# EAGLE schematic pi3_hat (EAGLE 9.6.0)
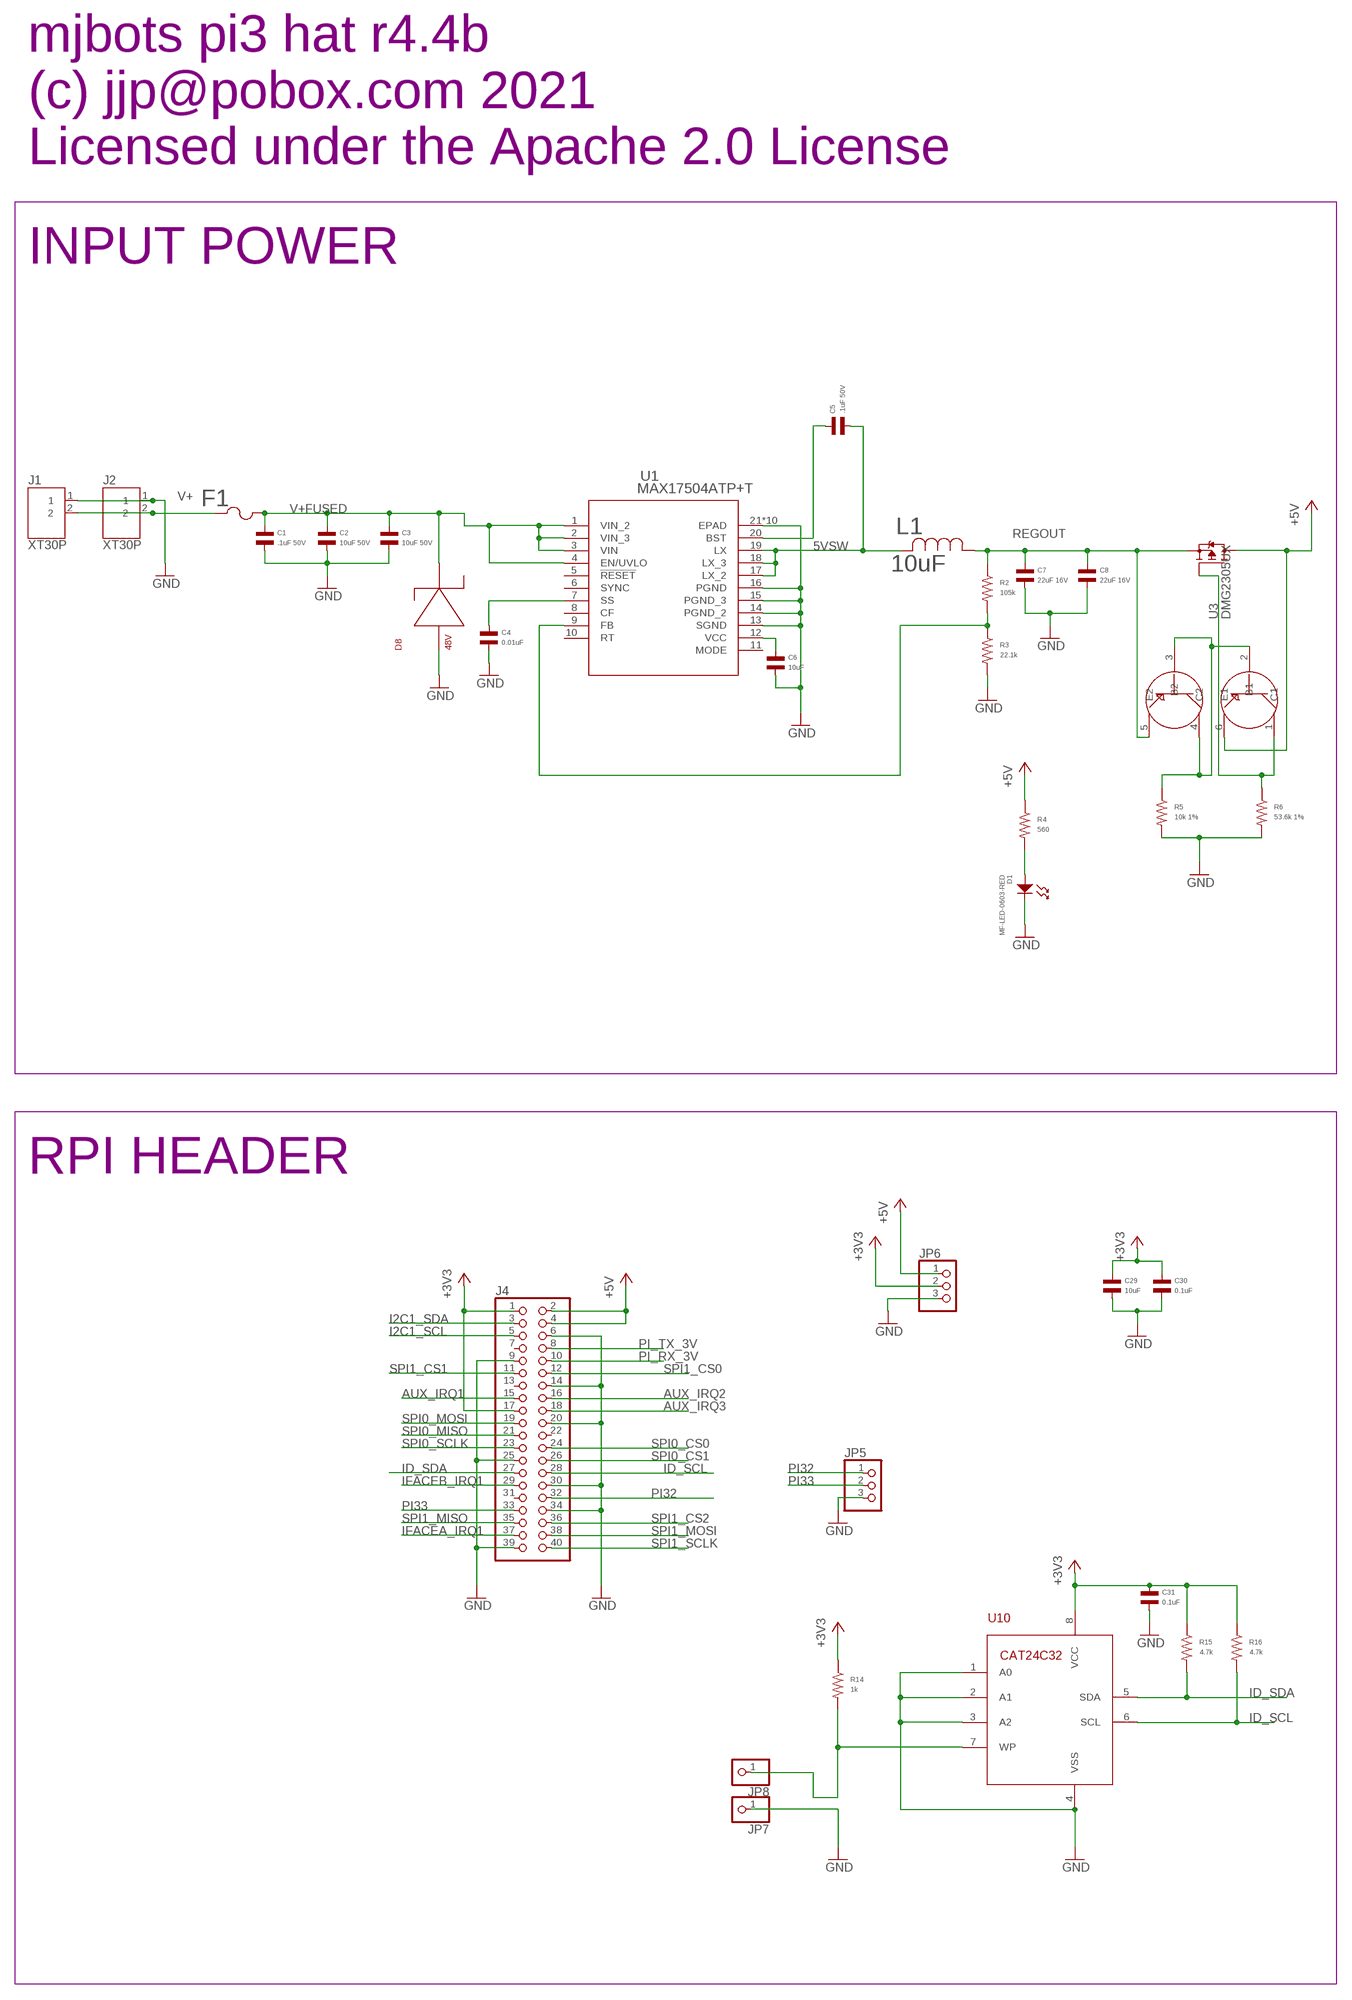
[diagram p0: schematic, sheet 1, part 1 of 3]
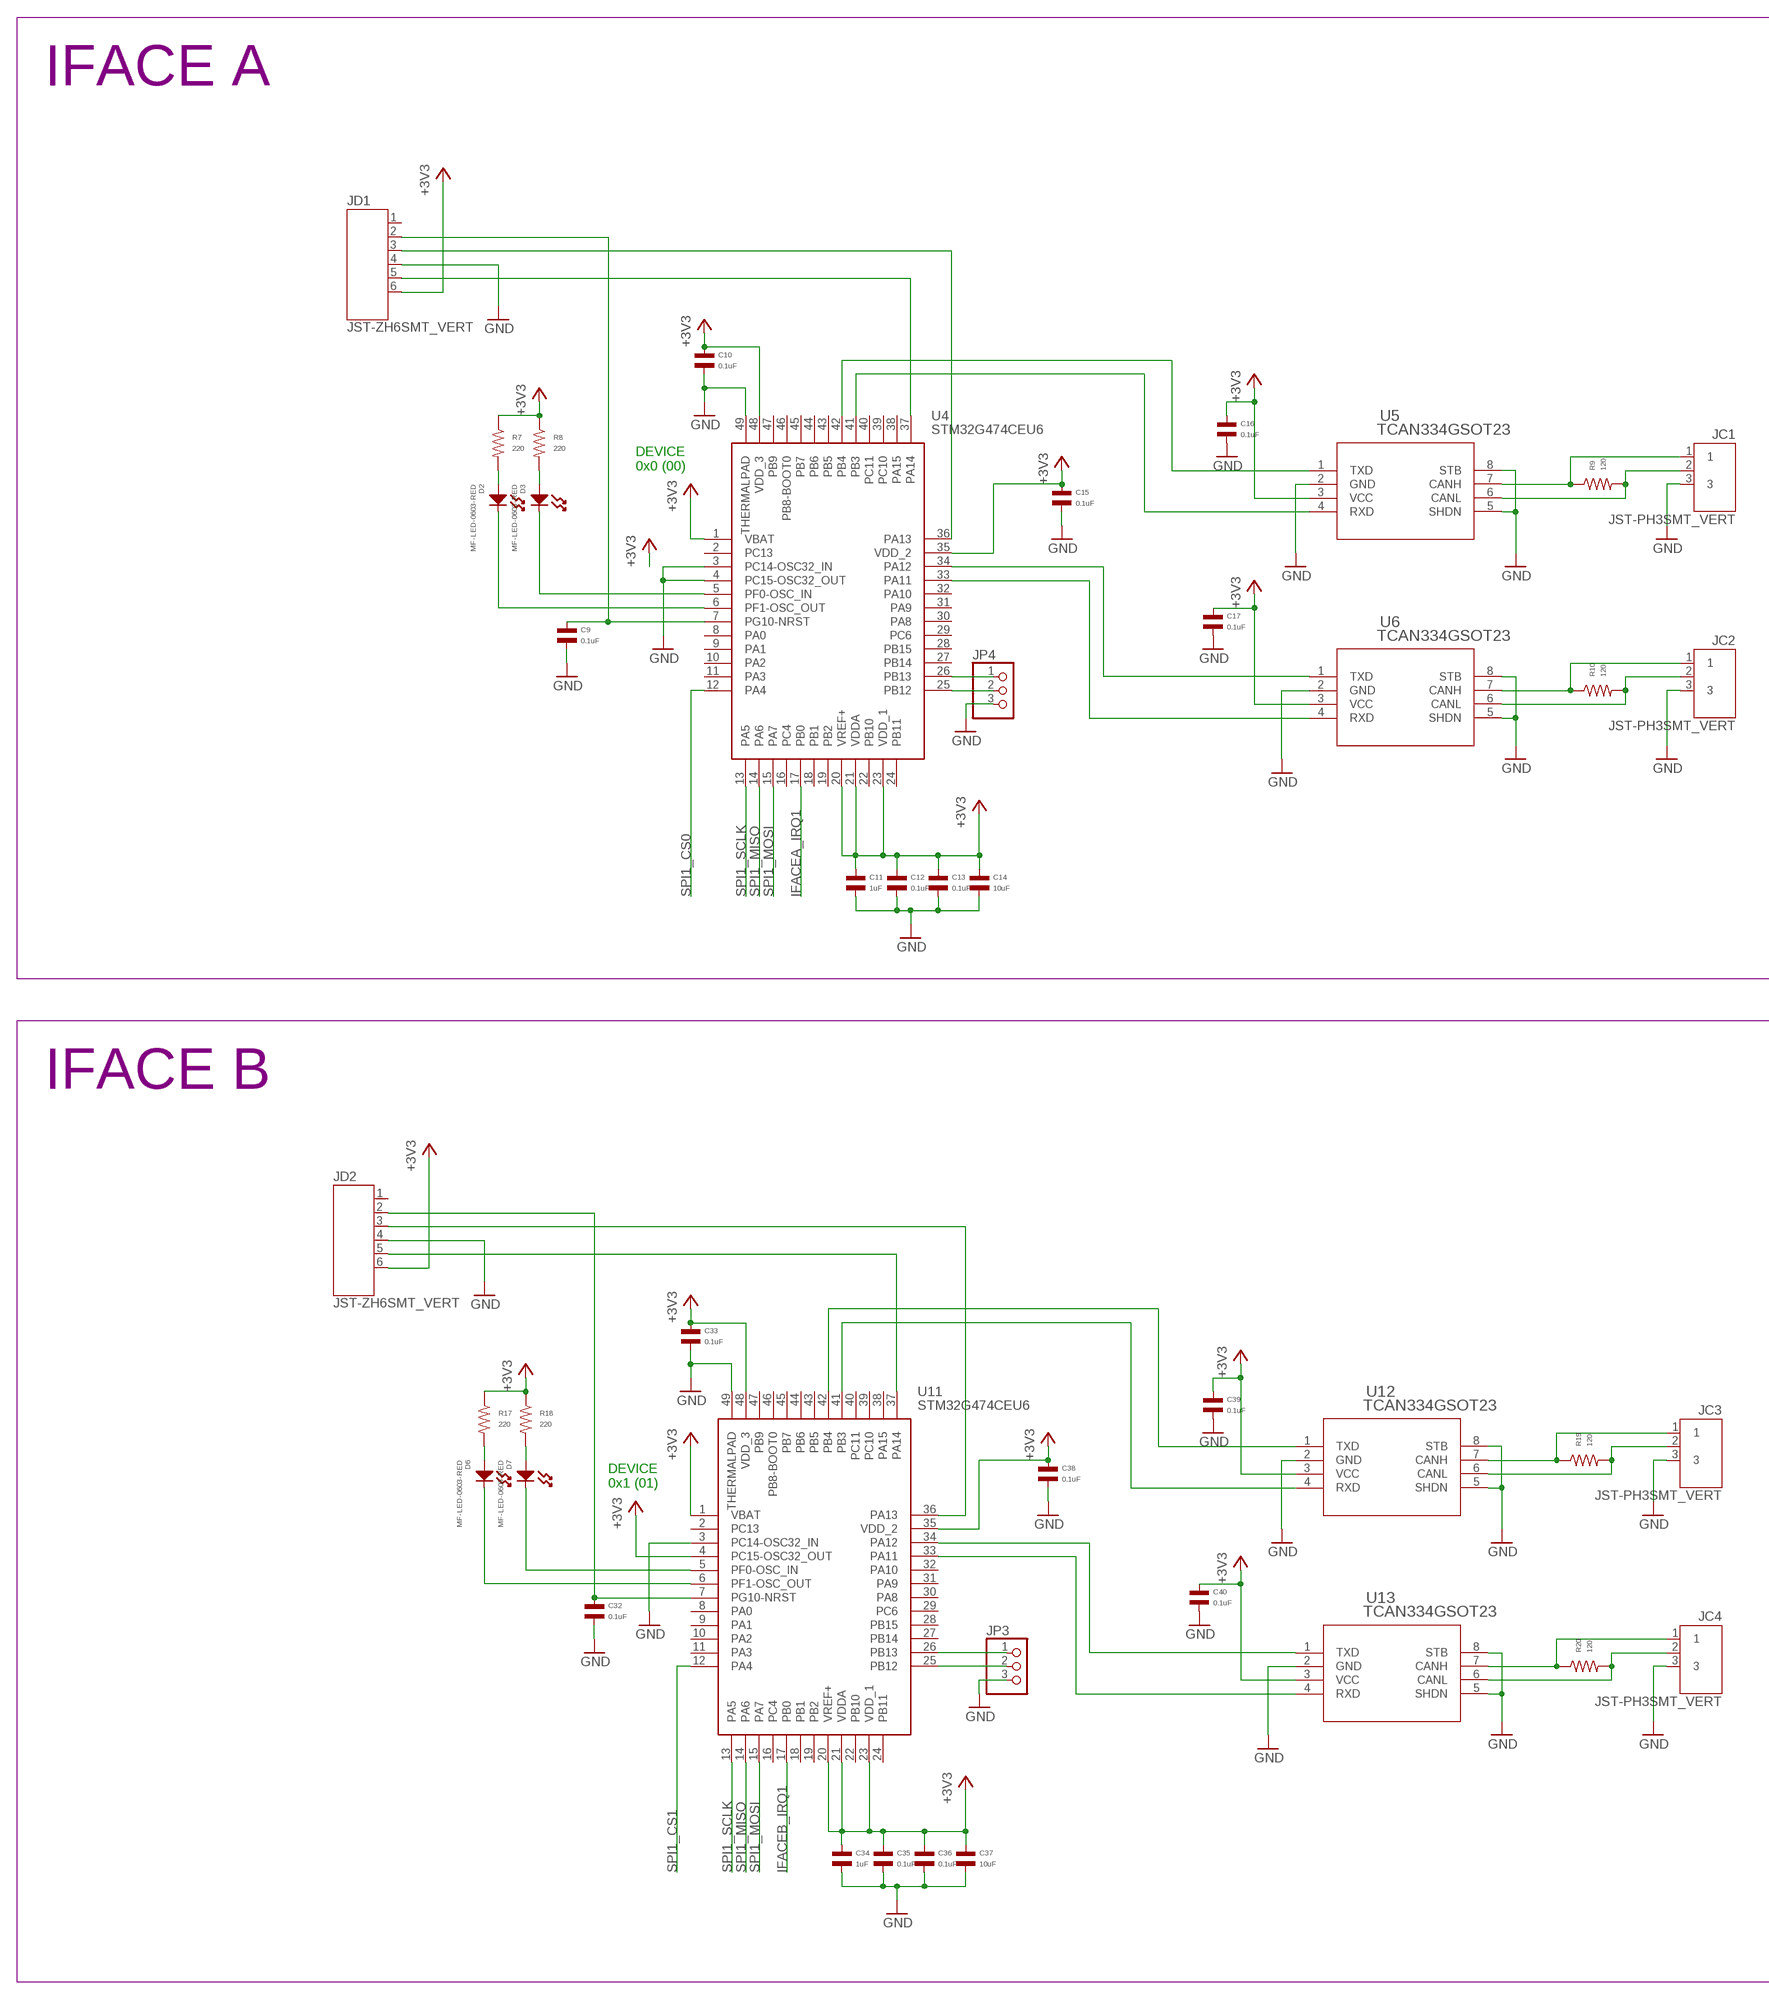
[diagram p1: schematic, sheet 1, part 2 of 3]
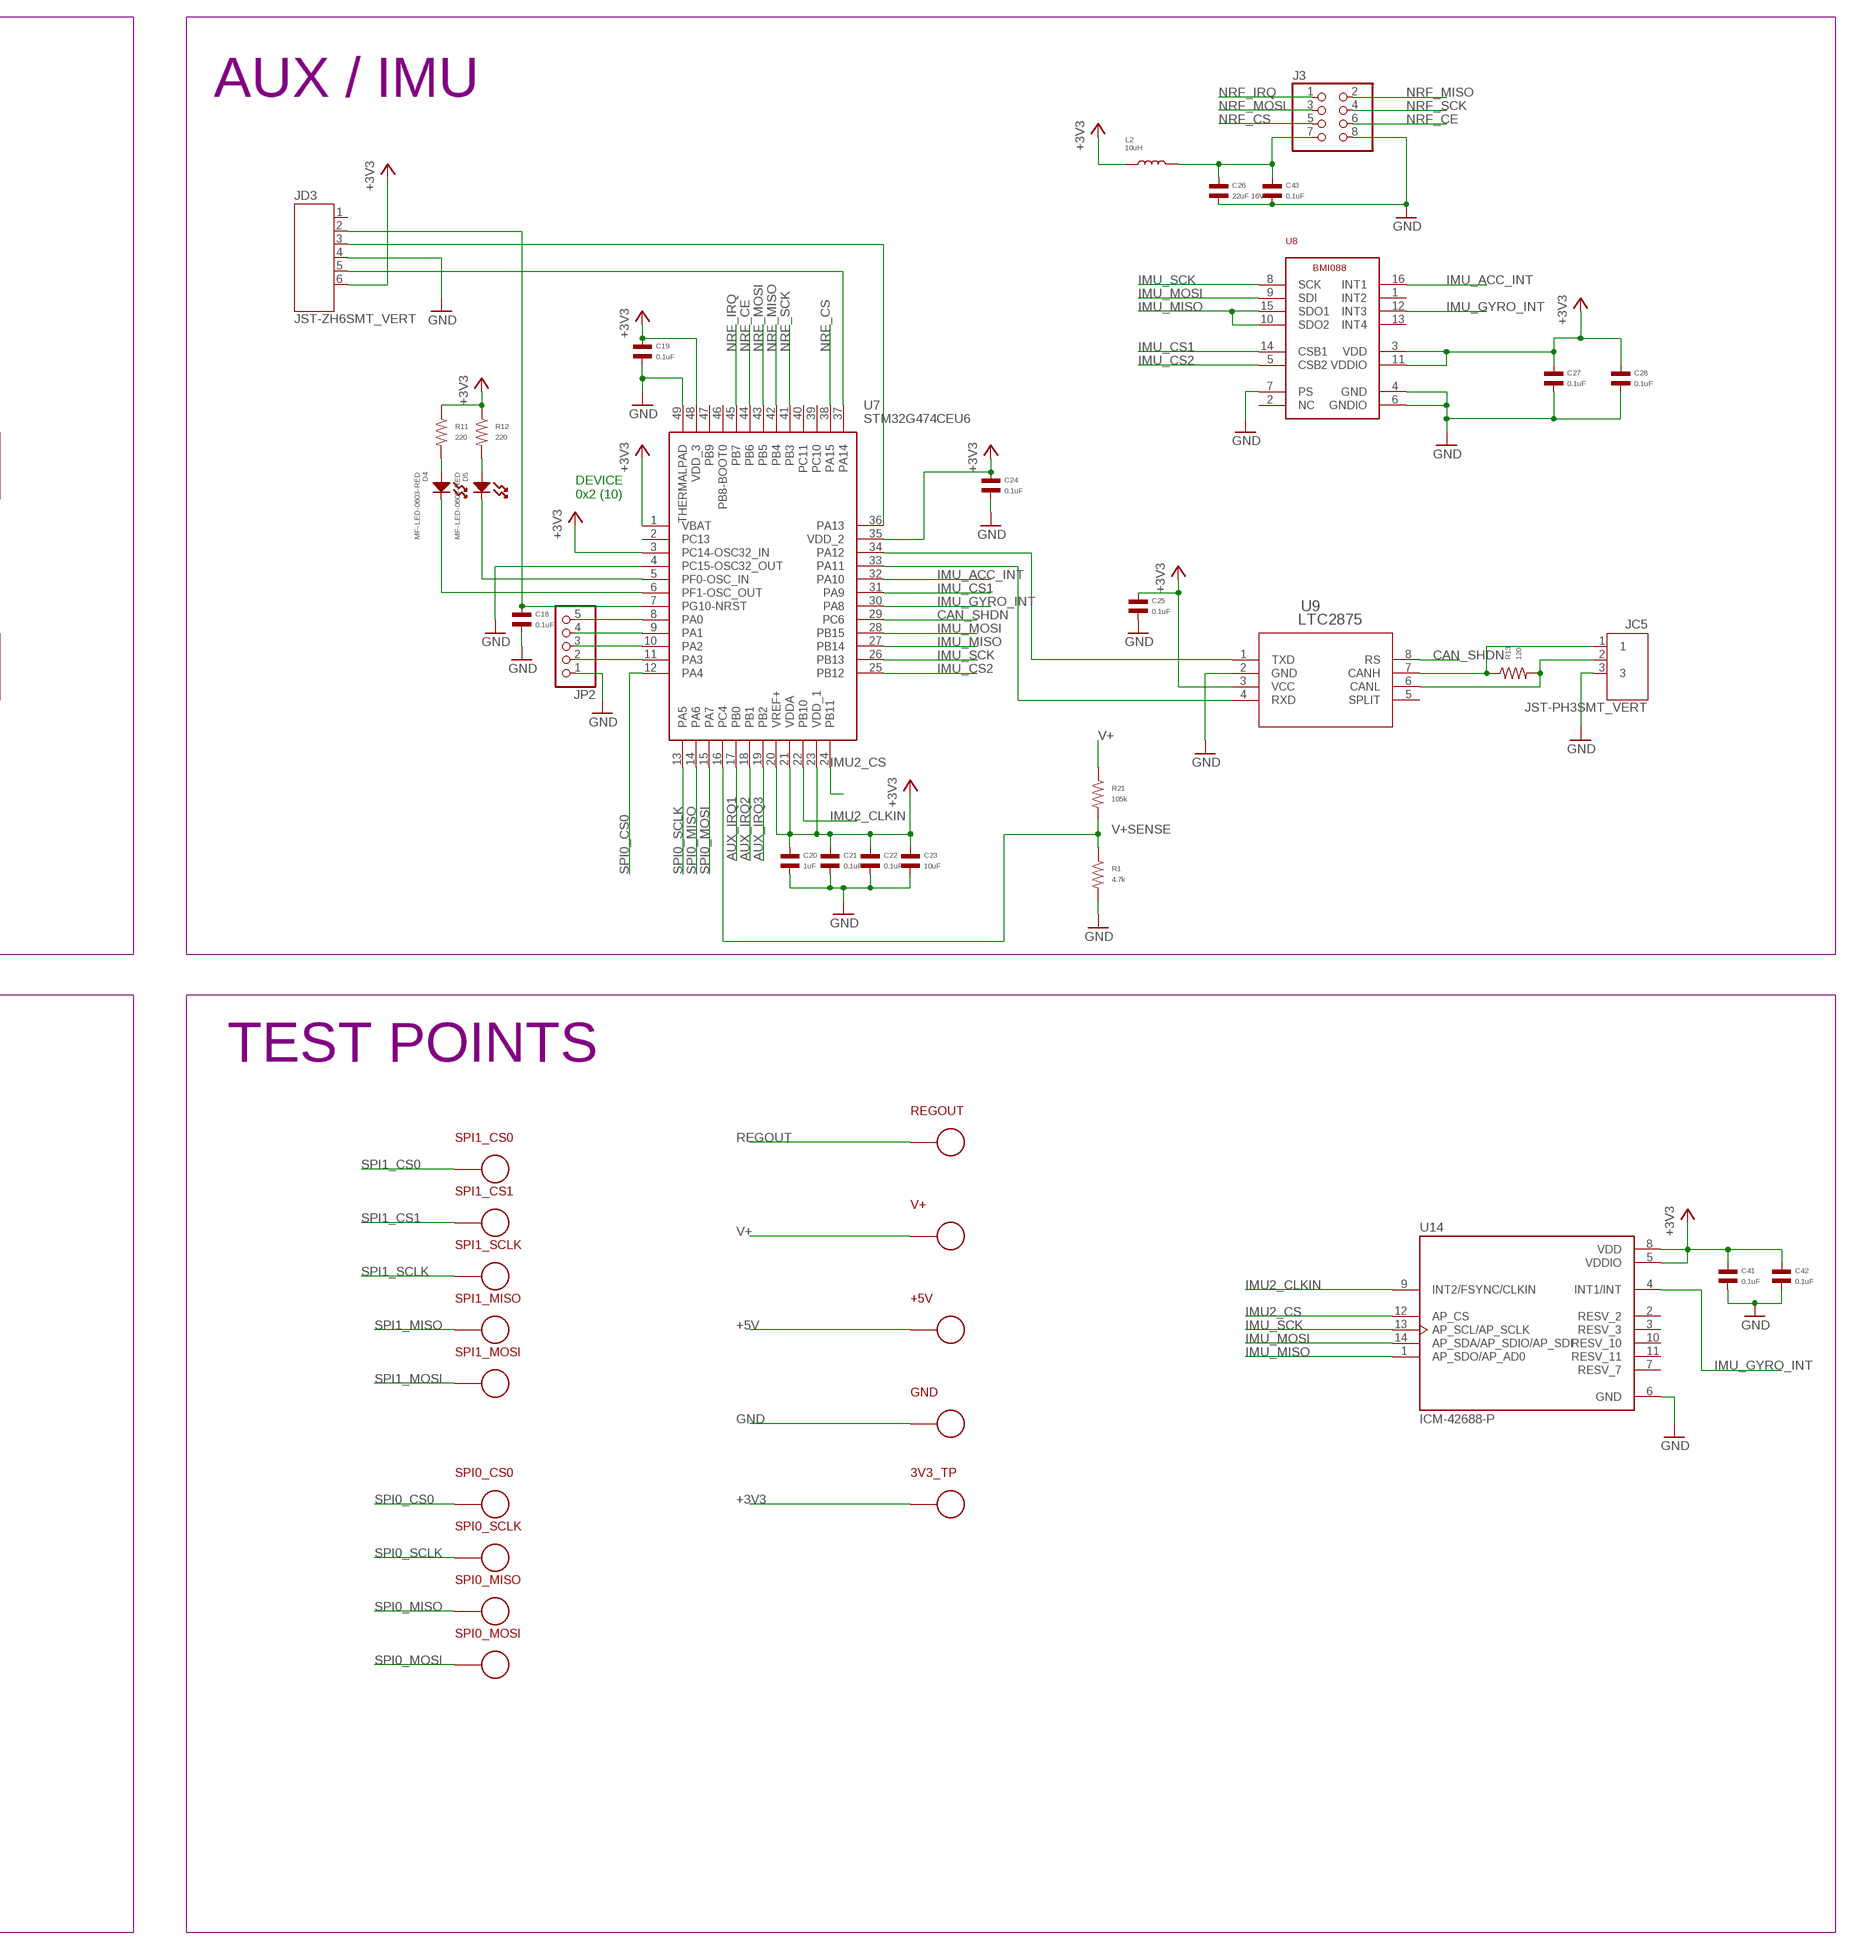
[diagram p2: schematic, sheet 1, part 3 of 3]

## Parts
3V3_TP  PAD24AWG_PAD  [24AWG_PAD]
+5V  PAD24AWG_PAD  [24AWG_PAD]
C1  .1uF 50V  CAPACITOR_NP_0805  [C0805]
C2  10uF 50V  CAPACITOR_NP_1206  [C1206]
C3  10uF 50V  CAPACITOR_NP_1206  [C1206]
C4  0.01uF  CAPACITOR_NP_0603  [C0603]
C5  .1uF 50V  CAPACITOR_NP_0805  [C0805]
C6  10uF  CAPACITOR_NP_1206  [C1206]
C7  22uF 16V  CAPACITOR_NP_1210  [C1210]
C8  22uF 16V  CAPACITOR_NP_1210  [C1210]
C9  0.1uF  CAPACITOR_NP_0402  [C0402]
C10  0.1uF  CAPACITOR_NP_0402  [C0402]
C11  1uF  CAPACITOR_NP_0402  [C0402]
C12  0.1uF  CAPACITOR_NP_0402  [C0402]
C13  0.1uF  CAPACITOR_NP_0402  [C0402]
C14  10uF  CAPACITOR_NP_1206  [C1206]
C15  0.1uF  CAPACITOR_NP_0402  [C0402]
C16  0.1uF  CAPACITOR_NP_0402  [C0402]
C17  0.1uF  CAPACITOR_NP_0402  [C0402]
C18  0.1uF  CAPACITOR_NP_0402  [C0402]
C19  0.1uF  CAPACITOR_NP_0402  [C0402]
C20  1uF  CAPACITOR_NP_0402  [C0402]
C21  0.1uF  CAPACITOR_NP_0402  [C0402]
C22  0.1uF  CAPACITOR_NP_0402  [C0402]
C23  10uF  CAPACITOR_NP_1206  [C1206]
C24  0.1uF  CAPACITOR_NP_0402  [C0402]
C25  0.1uF  CAPACITOR_NP_0402  [C0402]
C26  22uF 16V  CAPACITOR_NP_1210  [C1210]
C27  0.1uF  CAPACITOR_NP_0402  [C0402]
C28  0.1uF  CAPACITOR_NP_0402  [C0402]
C29  10uF  CAPACITOR_NP_1206  [C1206]
C30  0.1uF  CAPACITOR_NP_0402  [C0402]
C31  0.1uF  CAPACITOR_NP_0402  [C0402]
C32  0.1uF  CAPACITOR_NP_0402  [C0402]
C33  0.1uF  CAPACITOR_NP_0402  [C0402]
C34  1uF  CAPACITOR_NP_0402  [C0402]
C35  0.1uF  CAPACITOR_NP_0402  [C0402]
C36  0.1uF  CAPACITOR_NP_0402  [C0402]
C37  10uF  CAPACITOR_NP_1206  [C1206]
C38  0.1uF  CAPACITOR_NP_0402  [C0402]
C39  0.1uF  CAPACITOR_NP_0402  [C0402]
C40  0.1uF  CAPACITOR_NP_0402  [C0402]
C41  0.1uF  CAPACITOR_NP_0402  [C0402]
C42  0.1uF  CAPACITOR_NP_0402  [C0402]
C43  0.1uF  CAPACITOR_NP_0402  [C0402]
D1  MF-LED-0603-RED  LED_SINGLE-0603-RED  [LED0603]
D2  MF-LED-0603-RED  LED_SINGLE-0603-RED  [LED0603]
D3  MF-LED-0603-RED  LED_SINGLE-0603-RED  [LED0603]
D4  MF-LED-0603-RED  LED_SINGLE-0603-RED  [LED0603]
D5  MF-LED-0603-RED  LED_SINGLE-0603-RED  [LED0603]
D6  MF-LED-0603-RED  LED_SINGLE-0603-RED  [LED0603]
D7  MF-LED-0603-RED  LED_SINGLE-0603-RED  [LED0603]
D8  48V  SMF  [SMF]
F1  MFU0603FF04000P100  [FUS_VISHAY_MFU0603]
GND  PAD24AWG_PAD  [24AWG_PAD]
J1  XT30P  [XT30P]
J2  XT30P  [XT30P]
J3  PINHD-2X4  [2X04]
J4  PI3_HEADER2X20-FLIP  [2X20FLIP]
JC1  JST-PH3SMT_VERT  [JST_B3B_PH-SM4-TB(LF)(SN)]
JC2  JST-PH3SMT_VERT  [JST_B3B_PH-SM4-TB(LF)(SN)]
JC3  JST-PH3SMT_VERT  [JST_B3B_PH-SM4-TB(LF)(SN)]
JC4  JST-PH3SMT_VERT  [JST_B3B_PH-SM4-TB(LF)(SN)]
JC5  JST-PH3SMT_VERT  [JST_B3B_PH-SM4-TB(LF)(SN)]
JD1  JST-ZH6SMT_VERT  [JST_B6B-ZR-SM4-TF(LF)(SN)]
JD2  JST-ZH6SMT_VERT  [JST_B6B-ZR-SM4-TF(LF)(SN)]
JD3  JST-ZH6SMT_VERT  [JST_B6B-ZR-SM4-TF(LF)(SN)]
JP2  PINHD-1X5  [1X05]
JP3  PINHD-1X3  [1X03]
JP4  PINHD-1X3  [1X03]
JP5  PINHD-1X3  [1X03]
JP6  PINHD-1X3  [1X03]
JP7  PINHD-1X1  [1X01]
JP8  PINHD-1X1  [1X01]
L1  10uF  NS10165T100MNA  [IND_YUDEN_NS10165_YDN]
L2  10uH  INDUCTOR_1210  [L1210]
R1  4.7k  RESISTOR_0402  [R0402]
R2  105k  RESISTOR_0402  [R0402]
R3  22.1k  RESISTOR_0402  [R0402]
R4  560  RESISTOR_0402  [R0402]
R5  10k 1%  RESISTOR_0603  [R0603]
R6  53.6k 1%  RESISTOR_0603  [R0603]
R7  220  RESISTOR_0402  [R0402]
R8  220  RESISTOR_0402  [R0402]
R9  120  RESISTOR_0402  [R0402]
R10  120  RESISTOR_0402  [R0402]
R11  220  RESISTOR_0402  [R0402]
R12  220  RESISTOR_0402  [R0402]
R13  120  RESISTOR_0402  [R0402]
R14  1k  RESISTOR_0402  [R0402]
R15  4.7k  RESISTOR_0402  [R0402]
R16  4.7k  RESISTOR_0402  [R0402]
R17  220  RESISTOR_0402  [R0402]
R18  220  RESISTOR_0402  [R0402]
R19  120  RESISTOR_0402  [R0402]
R20  120  RESISTOR_0402  [R0402]
R21  105k  RESISTOR_0402  [R0402]
REGOUT  PAD24AWG_PAD  [24AWG_PAD]
SPI0_CS0  PAD24AWG_PAD  [24AWG_PAD]
SPI0_MISO  PAD24AWG_PAD  [24AWG_PAD]
SPI0_MOSI  PAD24AWG_PAD  [24AWG_PAD]
SPI0_SCLK  PAD24AWG_PAD  [24AWG_PAD]
SPI1_CS0  PAD24AWG_PAD  [24AWG_PAD]
SPI1_CS1  PAD24AWG_PAD  [24AWG_PAD]
SPI1_MISO  PAD24AWG_PAD  [24AWG_PAD]
SPI1_MOSI  PAD24AWG_PAD  [24AWG_PAD]
SPI1_SCLK  PAD24AWG_PAD  [24AWG_PAD]
U1  MAX17504ATP+T  [21-0140L_T2055-4_MXM]
U2  DMMT5401  [SOT26]
U3  DMG2305UX  [SOT23]
U4  STM32G474CEU6  [QFN50P700X700X60-49N]
U5  TCAN334GSOT23  [SOT23-8]
U6  TCAN334GSOT23  [SOT23-8]
U7  STM32G474CEU6  [QFN50P700X700X60-49N]
U8  BMI088LGA16  [LGA16]
U9  LTC2875  [SOIC8]
U10  CAT24C32UDFN8  [UDFN8_2X3_ONS]
U11  STM32G474CEU6  [QFN50P700X700X60-49N]
U12  TCAN334GSOT23  [SOT23-8]
U13  TCAN334GSOT23  [SOT23-8]
U14  ICM-42688-P  [PQFN50P300X250X97-14N]
V+  PAD24AWG_PAD  [24AWG_PAD]

## Nets
5VSW: C5.P$2 L1.2 U1.17(LX_2) U1.18(LX_3) U1.19(LX)
+3V3: 3V3_TP.P$1 C10.P$1 C11.P$1 C12.P$1 C13.P$1 C14.P$1 C15.P$1 C16.P$1 C17.P$1 C19.P$1 C20.P$1 C21.P$1 C22.P$1 C23.P$1 C24.P$1 C25.P$1 C27.P$1 C28.P$1 C29.P$1 C30.P$1 C31.P$1 C33.P$1 C34.P$1 C35.P$1 C36.P$1 C37.P$1 C38.P$1 C39.P$1 C40.P$1 C41.P$1 C42.P$1 J4.1 J4.17 JD1.6 JD2.6 JD3.6 JP6.2 L2.P$1 R7.P$1 R8.P$1 R11.P$1 R12.P$1 R14.P$1 R15.P$1 R16.P$1 R17.P$1 R18.P$1 U4.1(VBAT) U4.20(VREF+) U4.21(VDDA) U4.23(VDD_1) U4.35(VDD_2) U4.48(VDD_3) U5.3(VCC) U6.3(VCC) U7.1(VBAT) U7.3(PC14-OSC32_IN) U7.20(VREF+) U7.21(VDDA) U7.23(VDD_1) U7.35(VDD_2) U7.48(VDD_3) U8.3(VDD) U8.11(VDDIO) U9.3(VCC) U10.8(VCC) U11.1(VBAT) U11.4(PC15-OSC32_OUT) U11.20(VREF+) U11.21(VDDA) U11.23(VDD_1) U11.35(VDD_2) U11.48(VDD_3) U12.3(VCC) U13.3(VCC) U14.5(VDDIO) U14.8(VDD)
+5V: +5V.P$1 J4.2 J4.4 JP6.1 R4.P$1 U2.6(E1) U3.3(D)
AUX_IRQ1: J4.15 U7.17(PB0)
AUX_IRQ2: J4.16 U7.18(PB1)
AUX_IRQ3: J4.18 U7.19(PB2)
CAN_SHDN: U7.29(PC6) U9.8(RS)
FB: R2.P$2 R3.P$1 U1.9(FB)
GND: C1.P$2 C2.P$2 C3.P$2 C4.P$2 C6.P$2 C7.P$2 C8.P$2 C9.P$2 C10.P$2 C11.P$2 C12.P$2 C13.P$2 C14.P$2 C15.P$2 C16.P$2 C17.P$2 C18.P$2 C19.P$2 C20.P$2 C21.P$2 C22.P$2 C23.P$2 C24.P$2 C25.P$2 C26.P$2 C27.P$2 C28.P$2 C29.P$2 C30.P$2 C31.P$2 C32.P$2 C33.P$2 C34.P$2 C35.P$2 C36.P$2 C37.P$2 C38.P$2 C39.P$2 C40.P$2 C41.P$2 C42.P$2 C43.P$2 D1.CATHODE D8.A GND.P$1 J1.1 J2.1 J3.8 J4.6 J4.9 J4.14 J4.20 J4.25 J4.30 J4.34 J4.39 JC1.3 JC2.3 JC3.3 JC4.3 JC5.3 JD1.4 JD2.4 JD3.4 JP2.1 JP3.3 JP4.3 JP5.3 JP6.3 JP7.1 R1.P$2 R3.P$2 R5.P$2 R6.P$2 U1.13(SGND) U1.14(PGND_2) U1.15(PGND_3) U1.16(PGND) U1.21(EPAD) U1.22(EPAD) U1.23(EPAD) U1.24(EPAD) U1.25(EPAD) U1.26(EPAD) U1.27(EPAD) U1.28(EPAD) U1.29(EPAD) U1.30(EPAD) U4.3(PC14-OSC32_IN) U4.4(PC15-OSC32_OUT) U4.49(THERMALPAD) U5.2(GND) U5.5(SHDN) U5.8(STB) U6.2(GND) U6.5(SHDN) U6.8(STB) U7.4(PC15-OSC32_OUT) U7.49(THERMALPAD) U8.4(GND) U8.6(GNDIO) U8.7(PS) U9.2(GND) U10.1(A0) U10.2(A1) U10.3(A2) U10.4(VSS) U11.3(PC14-OSC32_IN) U11.49(THERMALPAD) U12.2(GND) U12.5(SHDN) U12.8(STB) U13.2(GND) U13.5(SHDN) U13.8(STB) U14.6(GND)
I2C1_SCL: J4.5
I2C1_SDA: J4.3
ID_SCL: J4.28 R16.P$2 U10.6(SCL)
ID_SDA: J4.27 R15.P$2 U10.5(SDA)
IFACEA_IRQ1: J4.37 U4.17(PB0)
IFACEB_IRQ1: J4.29 U11.17(PB0)
IMU2_CLKIN: U7.22(PB10) U14.9(INT2/FSYNC/CLKIN)
IMU2_CS: U7.24(PB11) U14.12(AP_CS)
IMU_ACC_INT: U7.32(PA10) U8.16(INT1)
IMU_CS1: U7.31(PA9) U8.14(CSB1)
IMU_CS2: U7.25(PB12) U8.5(CSB2)
IMU_GYRO_INT: U7.30(PA8) U8.12(INT3) U14.4(INT1/INT)
IMU_MISO: U7.27(PB14) U8.10(SDO2) U8.15(SDO1) U14.1(AP_SDO/AP_AD0)
IMU_MOSI: U7.28(PB15) U8.9(SDI) U14.14(AP_SDA/AP_SDIO/AP_SDI)
IMU_SCK: U7.26(PB13) U8.8(SCK) U14.13(AP_SCL/AP_SCLK)
N$1: R5.P$1 U2.2(B1) U2.3(B2) U2.4(C2)
N$2: JC1.1 R9.P$1 U5.7(CANH)
N$3: JP3.2 U11.25(PB12)
N$4: JC1.2 R9.P$2 U5.6(CANL)
N$5: R6.P$1 U2.1(C1) U3.1(G)
N$6: JP2.2 U7.11(PA3)
N$7: JC2.1 R10.P$1 U6.7(CANH)
N$8: JC2.2 R10.P$2 U6.6(CANL)
N$9: D1.ANODE R4.P$2
N$10: JP2.3 U7.10(PA2)
N$11: U4.33(PA11) U6.4(RXD)
N$12: JP2.4 U7.9(PA1)
N$13: C9.P$1 JD1.2 U4.7(PG10-NRST)
N$14: C5.P$1 U1.20(BST)
N$15: JD1.3 U4.36(PA13)
N$16: JD1.5 U4.37(PA14)
N$17: U4.41(PB3) U5.4(RXD)
N$18: U4.42(PB4) U5.1(TXD)
N$19: C4.P$1 U1.7(SS)
N$20: JP2.5 U7.8(PA0)
N$21: C6.P$1 U1.12(VCC)
N$23: JC3.1 R19.P$1 U12.7(CANH)
N$25: JC3.2 R19.P$2 U12.6(CANL)
N$26: JC4.1 R20.P$1 U13.7(CANH)
N$27: JC4.2 R20.P$2 U13.6(CANL)
N$28: D3.ANODE R8.P$2
N$29: D3.CATHODE U4.5(PF0-OSC_IN)
N$30: D2.ANODE R7.P$2
N$31: D2.CATHODE U4.6(PF1-OSC_OUT)
N$32: C32.P$1 JD2.2 U11.7(PG10-NRST)
N$33: JD2.3 U11.36(PA13)
N$34: JD2.5 U11.37(PA14)
N$35: D7.ANODE R18.P$2
N$36: D7.CATHODE U11.5(PF0-OSC_IN)
N$37: D6.ANODE R17.P$2
N$38: D6.CATHODE U11.6(PF1-OSC_OUT)
N$39: U11.33(PA11) U13.4(RXD)
N$40: U11.34(PA12) U13.1(TXD)
N$41: U11.41(PB3) U12.4(RXD)
N$42: U11.42(PB4) U12.1(TXD)
N$43: JP3.1 U11.26(PB13)
N$44: JP8.1 R14.P$2 U10.7(WP)
N$45: JC5.1 R13.P$1 U9.7(CANH)
N$46: JC5.2 R13.P$2 U9.6(CANL)
N$47: C18.P$1 JD3.2 U7.7(PG10-NRST)
N$48: JD3.3 U7.36(PA13)
N$49: JD3.5 U7.37(PA14)
N$50: D5.ANODE R12.P$2
N$51: D5.CATHODE U7.5(PF0-OSC_IN)
N$52: D4.ANODE R11.P$2
N$53: D4.CATHODE U7.6(PF1-OSC_OUT)
N$54: U7.33(PA11) U9.4(RXD)
N$55: U7.34(PA12) U9.1(TXD)
N$56: C26.P$1 C43.P$1 J3.7 L2.P$2
N$57: JP4.2 U4.25(PB12)
N$58: JP4.1 U4.26(PB13)
N$100: U4.34(PA12) U6.1(TXD)
NRF_CE: J3.6 U7.44(PB6)
NRF_CS: J3.5 U7.38(PA15)
NRF_IRQ: J3.1 U7.45(PB7)
NRF_MISO: J3.2 U7.42(PB4)
NRF_MOSI: J3.3 U7.43(PB5)
NRF_SCK: J3.4 U7.41(PB3)
PI32: J4.32 JP5.1
PI33: J4.33 JP5.2
PI_RX_3V: J4.10
PI_TX_3V: J4.8
REGOUT: C7.P$1 C8.P$1 L1.1 R2.P$1 REGOUT.P$1 U2.5(E2) U3.2(S)
SPI0_CS0: J4.24 SPI0_CS0.P$1 U7.12(PA4)
SPI0_CS1: J4.26
SPI0_MISO: J4.21 SPI0_MISO.P$1 U7.14(PA6)
SPI0_MOSI: J4.19 SPI0_MOSI.P$1 U7.15(PA7)
SPI0_SCLK: J4.23 SPI0_SCLK.P$1 U7.13(PA5)
SPI1_CS0: J4.12 SPI1_CS0.P$1 U4.12(PA4)
SPI1_CS1: J4.11 SPI1_CS1.P$1 U11.12(PA4)
SPI1_CS2: J4.36
SPI1_MISO: J4.35 SPI1_MISO.P$1 U4.14(PA6) U11.14(PA6)
SPI1_MOSI: J4.38 SPI1_MOSI.P$1 U4.15(PA7) U11.15(PA7)
SPI1_SCLK: J4.40 SPI1_SCLK.P$1 U4.13(PA5) U11.13(PA5)
V+: F1.1 J1.2 J2.2 R21.P$1 V+.P$1
V+FUSED: C1.P$1 C2.P$1 C3.P$1 D8.C F1.2 U1.1(VIN_2) U1.2(VIN_3) U1.3(VIN) U1.4(EN/UVLO)
V+SENSE: R1.P$1 R21.P$2 U7.16(PC4)
Unconnected: J4.7 J4.13 J4.22 J4.31 JD1.1 JD2.1 JD3.1 U1.5(!RESET) U1.6(SYNC) U1.8(CF) U1.10(RT) U1.11(MODE) U4.2(PC13) U4.8(PA0) U4.9(PA1) U4.10(PA2) U4.11(PA3) U4.16(PC4) U4.18(PB1) U4.19(PB2) U4.22(PB10) U4.24(PB11) U4.27(PB14) U4.28(PB15) U4.29(PC6) U4.30(PA8) U4.31(PA9) U4.32(PA10) U4.38(PA15) U4.39(PC10) U4.40(PC11) U4.43(PB5) U4.44(PB6) U4.45(PB7) U4.46(PB8-BOOT0) U4.47(PB9) U7.2(PC13) U7.39(PC10) U7.40(PC11) U7.46(PB8-BOOT0) U7.47(PB9) U8.1(INT2) U8.2(NC) U8.13(INT4) U9.5(SPLIT) U11.2(PC13) U11.8(PA0) U11.9(PA1) U11.10(PA2) U11.11(PA3) U11.16(PC4) U11.18(PB1) U11.19(PB2) U11.22(PB10) U11.24(PB11) U11.27(PB14) U11.28(PB15) U11.29(PC6) U11.30(PA8) U11.31(PA9) U11.32(PA10) U11.38(PA15) U11.39(PC10) U11.40(PC11) U11.43(PB5) U11.44(PB6) U11.45(PB7) U11.46(PB8-BOOT0) U11.47(PB9) U14.2(RESV_2) U14.3(RESV_3) U14.7(RESV_7) U14.10(RESV_10) U14.11(RESV_11)

## Notes on the sheet
- mjbots pi3 hat r4.4b
  (c) jjp@pobox.com 2021
  Licensed under the Apache 2.0 License
- INPUT POWER | IFACE A | AUX / IMU
- DEVICE
  0x0 (00)
- DEVICE
  0x2 (10)
- RPI HEADER | IFACE B | TEST POINTS
- DEVICE
  0x1 (01)

## Library data of the parts
3V3_TP +5V GND REGOUT SPI0_CS0 SPI0_MISO SPI0_MOSI SPI0_SCLK SPI1_CS0 SPI1_CS1 SPI1_MISO SPI1_MOSI SPI1_SCLK V+ = pi3_hat:PAD; POPULATE: 0
C1 C5 = mfpassives:CAPACITOR_NP: Library: MF_Passives Description: Device for Non-Polarized Capacitors. Manufacture part number (MPN) can be added via Attributes. Check https://factory.macrofab.com/parts for the house parts list.; HOUSEPART: 1; MPN: MF-CAP-0805-0.1uF; POPULATE: 1
C2 C3 = mfpassives:CAPACITOR_NP: Library: MF_Passives Description: Device for Non-Polarized Capacitors. Manufacture part number (MPN) can be added via Attributes. Check https://factory.macrofab.com/parts for the house parts list.; MF: TDK; MPN: C3216X7R1H106K160AE; POPULATE: 1
C4 = mfpassives:CAPACITOR_NP: Library: MF_Passives Description: Device for Non-Polarized Capacitors. Manufacture part number (MPN) can be added via Attributes. Check https://factory.macrofab.com/parts for the house parts list.; MPN: MF-CAP-0603-0.01uF; POPULATE: 1
C6 C14 C23 C29 C37 = mfpassives:CAPACITOR_NP: Library: MF_Passives Description: Device for Non-Polarized Capacitors. Manufacture part number (MPN) can be added via Attributes. Check https://factory.macrofab.com/parts for the house parts list.; HOUSEPART: YES; MPN: MF-CAP-1206-10uF; POPULATE: 1
C7 C8 C26 = mfpassives:CAPACITOR_NP: Library: MF_Passives Description: Device for Non-Polarized Capacitors. Manufacture part number (MPN) can be added via Attributes. Check https://factory.macrofab.com/parts for the house parts list.; MF: SAMSUNG; MPN: CL32A226KOJNNNE; POPULATE: 1
C9 C10 C12 C13 C15-C19 C21 C22 C24 C25 C27 C28 C30-C33 C35 C36 C38-C43 = mfpassives:CAPACITOR_NP: Library: MF_Passives Description: Device for Non-Polarized Capacitors. Manufacture part number (MPN) can be added via Attributes. Check https://factory.macrofab.com/parts for the house parts list.; HOUSEPART: YES; MPN: MF-CAP-0402-0.1uF; POPULATE: 1
C11 C20 C34 = mfpassives:CAPACITOR_NP: Library: MF_Passives Description: Device for Non-Polarized Capacitors. Manufacture part number (MPN) can be added via Attributes. Check https://factory.macrofab.com/parts for the house parts list.; HOUSEPART: YES; MPN: MF-CAP-0402-1uF; POPULATE: 1
D1 D2 D4 D6 = mfleds:LED_SINGLE: Library: MF_LEDs Description: Device for Single LED Packages. Manufacture part number (MFG#) can be added via Attributes.; HOUSEPART: YES; MPN: MF-LED-0603-RED; POPULATE: 1; URL: https://factory.macrofab.com/part/MF-LED-0603-RED
D3 D5 D7 = mfleds:LED_SINGLE: Library: MF_LEDs Description: Device for Single LED Packages. Manufacture part number (MFG#) can be added via Attributes.; HOUSEPART: YES; MPN: MF-LED-0603-GREEN; POPULATE: 1; URL: https://factory.macrofab.com/part/MF-LED-0603-RED
D8 = pi3_hat:SMF; MF: Vishay; MPN: SMF48A-E3-08; POPULATE: 1
F1 = pi3_hat:MFU0603FF04000P100; DPN: 507-2154-1-ND; MF: BEL FUSE; MPN: 0686F4000-01; POPULATE: 1; VENDOR: BEL FUSE
J1 J2 = pi3_hat:XT30; POPULATE: 0
J3 = pinhead:PINHD-2X4: PIN HEADER; POPULATE: 0
J4 = pi3_hat:PI3_HEADER: PIN HEADER; MF: SULLINS; MPN: PPPC202LFBN-RC; POPULATE: 1
JC1-JC5 = pi3_hat:JST-PH3; MF: JST; MPN: B3B-PH-SM4-TB(LF)(SN); POPULATE: 1
JD1-JD3 = pi3_hat:JST-ZH6; MF: JST; MPN: B6B-ZR-SM4-TF(LF)(SN); POPULATE: 1
JP2 = pinhead:PINHD-1X5: PIN HEADER; MF: MacroFab; MPN: MF-CON-2.54mm-01x05; POPULATE: 0
JP3 JP4 = pinhead:PINHD-1X3: PIN HEADER; MF: MacroFab; MPN: MF-CON-2.54mm-01x03; POPULATE: 0
JP5 JP6 = pinhead:PINHD-1X3: PIN HEADER; MF: MacroFab; MPN: MF-CON-2.54mm-01x03; POPULATE: 1
JP7 JP8 = adafruit:PINHD-1X1: Pin header 1x1 for 0.1" spacing With round pins; POPULATE: 0
L1 = pi3_hat:NS10165T100MNA; BUILT_BY: EMA_UL_Team; MANUFACTURER_PART_NUMBER: NS10165T100MNA; MPN: NS10165T100MNA; POPULATE: 1; SOURCELIBRARY: Yuden_2012-01-01_IND_NS; VENDOR: Taiyo Yuden
L2 = mfpassives:INDUCTOR: Library: MF_Passives Description: Device for Inductors. Manufacture part number (MPN) can be added via Attributes. Check https://factory.macrofab.com/parts for the house parts list.; MPN: MF-IND-1210-10uH
R1 R15 R16 = mfpassives:RESISTOR: Library: MF_Passives Description: Device for Resistors. Manufacture part number (MPN), Voltage, Tolerance, and Wattage Rating can be added via Attributes. Check https://factory.macrofab.com/parts for the house parts list.; HOUSEPART: YES; MPN: MF-RES-0402-4.7K; POPULATE: 1
R2 R21 = mfpassives:RESISTOR: Library: MF_Passives Description: Device for Resistors. Manufacture part number (MPN), Voltage, Tolerance, and Wattage Rating can be added via Attributes. Check https://factory.macrofab.com/parts for the house parts list.; MF: YAGEO; MPN: RC0402FR-07105KL; POPULATE: 1
R3 = mfpassives:RESISTOR: Library: MF_Passives Description: Device for Resistors. Manufacture part number (MPN), Voltage, Tolerance, and Wattage Rating can be added via Attributes. Check https://factory.macrofab.com/parts for the house parts list.; MF: YAGEO; MPN: RC0402FR-0722K1L; POPULATE: 1
R4 = mfpassives:RESISTOR: Library: MF_Passives Description: Device for Resistors. Manufacture part number (MPN), Voltage, Tolerance, and Wattage Rating can be added via Attributes. Check https://factory.macrofab.com/parts for the house parts list.; HOUSEPART: YES; MPN: MF-RES-0402-560; POPULATE: 1
R5 = mfpassives:RESISTOR: Library: MF_Passives Description: Device for Resistors. Manufacture part number (MPN), Voltage, Tolerance, and Wattage Rating can be added via Attributes. Check https://factory.macrofab.com/parts for the house parts list.; MF: YAGEO; MPN: RC0603FR-0710KL; POPULATE: 1
R6 = mfpassives:RESISTOR: Library: MF_Passives Description: Device for Resistors. Manufacture part number (MPN), Voltage, Tolerance, and Wattage Rating can be added via Attributes. Check https://factory.macrofab.com/parts for the house parts list.; MF: YAGEO; MPN: RC0603FR-0753K6L; POPULATE: 1
R7 R8 R11 R12 R17 R18 = mfpassives:RESISTOR: Library: MF_Passives Description: Device for Resistors. Manufacture part number (MPN), Voltage, Tolerance, and Wattage Rating can be added via Attributes. Check https://factory.macrofab.com/parts for the house parts list.; HOUSEPART: YES; MPN: MF-RES-0402-220; POPULATE: 1
R9 R10 R13 R19 R20 = mfpassives:RESISTOR: Library: MF_Passives Description: Device for Resistors. Manufacture part number (MPN), Voltage, Tolerance, and Wattage Rating can be added via Attributes. Check https://factory.macrofab.com/parts for the house parts list.; HOUSEPART: YES; MPN: MF-RES-0402-100; POPULATE: 1
R14 = mfpassives:RESISTOR: Library: MF_Passives Description: Device for Resistors. Manufacture part number (MPN), Voltage, Tolerance, and Wattage Rating can be added via Attributes. Check https://factory.macrofab.com/parts for the house parts list.; HOUSEPART: YES; MPN: MF-RES-0402-1K; POPULATE: 1
U1 = pi3_hat:MAX17504ATP+T; BUILT_BY: EMA_UL_Team; COPYRIGHT: Copyright (C) 2018 Accelerated Designs. All rights reserved; MANUFACTURER_PART_NUMBER: MAX17504ATP+T; MPN: MAX17504ATP+T; POPULATE: 1; REVISION: 1; SOURCELIBRARY: Maxim_2018-11-30; VENDOR: Maxim Integrated Products
U2 = pi3_hat:DMMT5401; DPN: DMMT5401-FDICT-ND; MF: Didoes Incorporated; MPN: DMMT5401-7-F; POPULATE: 1
U3 = pi3_hat:DMG2305UX; DPN: DMG2305UX-13DICT-ND; MF: Diodes Incorporated; MPN: DMG2305UX-13; POPULATE: 1
U4 U7 U11 = pi3_hat:STM32G474CEU6: STMICROELECTRONICS - STM32G474CEU6 - MCU, 32BIT, 170MHZ, UFQFPN-48 Source: Datasheet <https://componentsearchengine.com/Datasheets/1/STM32G474CEU6.pdf>; DESCRIPTION: STMICROELECTRONICS - STM32G474CEU6 - MCU, 32BIT, 170MHZ, UFQFPN-48; HEIGHT: 0.6mm; MANUFACTURER_NAME: STMicroelectronics; MANUFACTURER_PART_NUMBER: STM32G474CEU6; MF: ST; MOUSER_PART_NUMBER: 511-STM32G474CEU6; MOUSER_PRICE-STOCK: https://www.mouser.com/Search/Refine.aspx?Keyword=511-STM32G474CEU6; MPN: STM32G474CEU6; POPULATE: 1
U5 U6 U12 U13 = pi3_hat:TCAN334G; MF: TI; MPN: TCAN334GDCNT; POPULATE: 1
U8 = pi3_hat:BMI088; MF: BOSCH; MPN: BMI088; POPULATE: 1
U9 = pi3_hat:LTC2875; MF: Analog; MPN: LTC2875IS8#PBF; POPULATE: 1
U10 = pi3_hat:CAT24C32; MF: ON Semiconductor; MPN: CAT24C32HU4I-GT3; POPULATE: 1
U14 = ICM-42688-P:ICM-42688-P: Accelerometer, Gyroscope, 6 Axis Sensor Output; DESCRIPTION: Accelerometer, Gyroscope, 6 Axis Sensor Output; DIGI-KEY_PART_NUMBER: 1428-ICM-42688-PCT-ND; MF: TDK InvenSense; MP: ICM-42688-P; PACKAGE: Package TDK - InvenSense